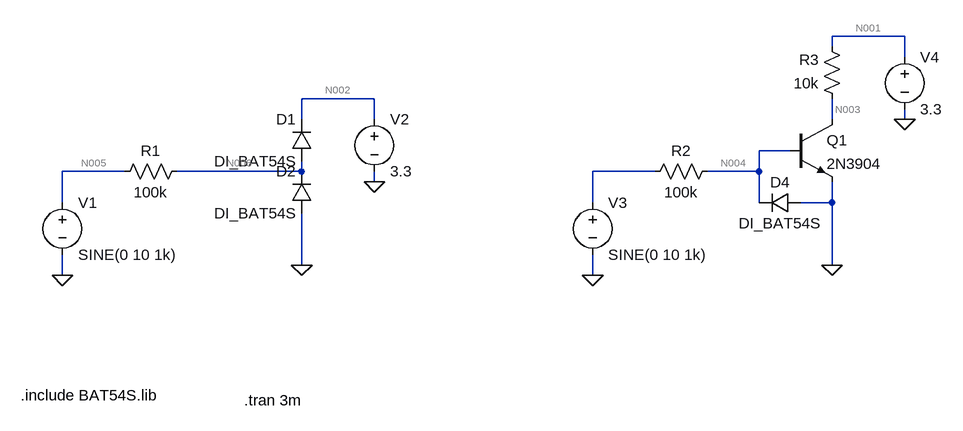
[diagram p0: schematic gate_input.asc]
gate_input.asc, the LTspice schematic file:
Version 4.1
SHEET 1 1360 680
WIRE 1296 -144 1184 -144
WIRE 1184 -128 1184 -144
WIRE 1296 -112 1296 -144
WIRE 480 -48 368 -48
WIRE 368 -16 368 -48
WIRE 480 -16 480 -48
WIRE 1184 -16 1184 -48
WIRE 1296 -16 1296 -32
WIRE 1120 32 1072 32
WIRE 96 64 0 64
WIRE 368 64 368 48
WIRE 368 64 176 64
WIRE 912 64 816 64
WIRE 1072 64 1072 32
WIRE 1072 64 992 64
WIRE 480 80 480 64
WIRE 0 112 0 64
WIRE 816 112 816 64
WIRE 1072 112 1072 64
WIRE 1184 112 1184 80
WIRE 1184 112 1136 112
WIRE 368 208 368 128
WIRE 1184 208 1184 112
WIRE 0 224 0 192
WIRE 816 224 816 192
FLAG 368 208 0
FLAG 0 224 0
FLAG 480 80 0
FLAG 1184 208 0
FLAG 816 224 0
FLAG 1296 -16 0
SYMBOL voltage 0 96 R0
WINDOW 123 0 0 Left 0
WINDOW 39 0 0 Left 0
SYMATTR InstName V1
SYMATTR Value SINE(0 10 1k)
SYMBOL diode 384 48 R180
WINDOW 0 24 64 Left 2
WINDOW 3 24 0 Left 2
SYMATTR InstName D1
SYMATTR Value DI_BAT54S
SYMBOL res 192 48 R90
WINDOW 0 0 56 VBottom 2
WINDOW 3 32 56 VTop 2
SYMATTR InstName R1
SYMATTR Value 100k
SYMBOL diode 384 128 R180
WINDOW 0 24 64 Left 2
WINDOW 3 24 0 Left 2
SYMATTR InstName D2
SYMATTR Value DI_BAT54S
SYMBOL voltage 480 -32 R0
WINDOW 123 0 0 Left 0
WINDOW 39 0 0 Left 0
SYMATTR InstName V2
SYMATTR Value 3.3
SYMBOL npn 1120 -16 R0
SYMATTR InstName Q1
SYMATTR Value 2N3904
SYMBOL voltage 816 96 R0
WINDOW 123 0 0 Left 0
WINDOW 39 0 0 Left 0
SYMATTR InstName V3
SYMATTR Value SINE(0 10 1k)
SYMBOL res 1008 48 R90
WINDOW 0 0 56 VBottom 2
WINDOW 3 32 56 VTop 2
SYMATTR InstName R2
SYMATTR Value 100k
SYMBOL diode 1136 96 R90
WINDOW 0 0 32 VBottom 2
WINDOW 3 32 32 VTop 2
SYMATTR InstName D4
SYMATTR Value DI_BAT54S
SYMBOL voltage 1296 -128 R0
WINDOW 123 0 0 Left 0
WINDOW 39 0 0 Left 0
SYMATTR InstName V4
SYMATTR Value 3.3
SYMBOL res 1200 -32 R180
WINDOW 0 36 76 Left 2
WINDOW 3 36 40 Left 2
SYMATTR InstName R3
SYMATTR Value 10k
TEXT -64 408 Left 2 !.include BAT54S.lib
TEXT 280 416 Left 2 !.tran 3m

The netlist it stands for:
* gate_input.asc
V1 N005 0 SINE(0 10 1k)
D1 N006 N002 DI_BAT54S
R1 N006 N005 100k
D2 0 N006 DI_BAT54S
V2 N002 0 3.3
Q1 N003 N004 0 0 2N3904
V3 N007 0 SINE(0 10 1k)
R2 N004 N007 100k
D4 0 N004 DI_BAT54S
V4 N001 0 3.3
R3 N003 N001 10k
.model D D
.lib standard.dio
.model NPN NPN
.model PNP PNP
.lib standard.bjt
.include BAT54S.lib
.tran 3m
.backanno
.end

* Results of the author's LTspice run, read from the files saved beside the schematic
* Operating Point, zero values left out:
*   V(n001) = 3.3 V
*   V(n002) = 3.3 V
*   V(n003) = 3.3 V
*   V(n004) = 5.488 nV
*   V(n006) = 176.1 mV
*   I(D1) = -34.9 µA
*   I(D2) = -33.14 µA
*   I(D4) = -3.248 pA
*   I(R1) = 1.761 µA
*   I(R3) = -3.313 pA
*   I(V1) = 1.761 µA
*   I(V2) = -34.9 µA
*   I(V4) = -3.313 pA
*   Ib(Q1) = -3.302 pA
*   Ic(Q1) = 3.313 pA
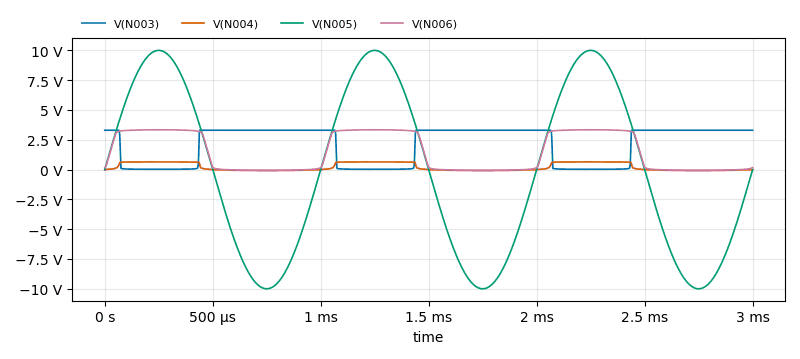
[diagram p1: Transient Analysis of gate_input.asc, plotted from the saved traces]
* Transient Analysis, 1 run:
*   V(N003): min 25.85 mV, max 3.303 V, average 2.113 V, rms 2.628 V, last 3.3 V
*   V(N004): min -79.42 mV, max 643.7 mV, average 218.4 mV, rms 393.1 mV, last -53.34 µV
*   V(N005): min -10 V, max 10 V, average 2.352 µV, rms 7.071 V, last 0 V
*   V(N006): min -61.73 mV, max 3.338 V, average 1.464 V, rms 2.162 V, last 169.4 mV